# Altium schematic sheet Interface.SchDoc
size A
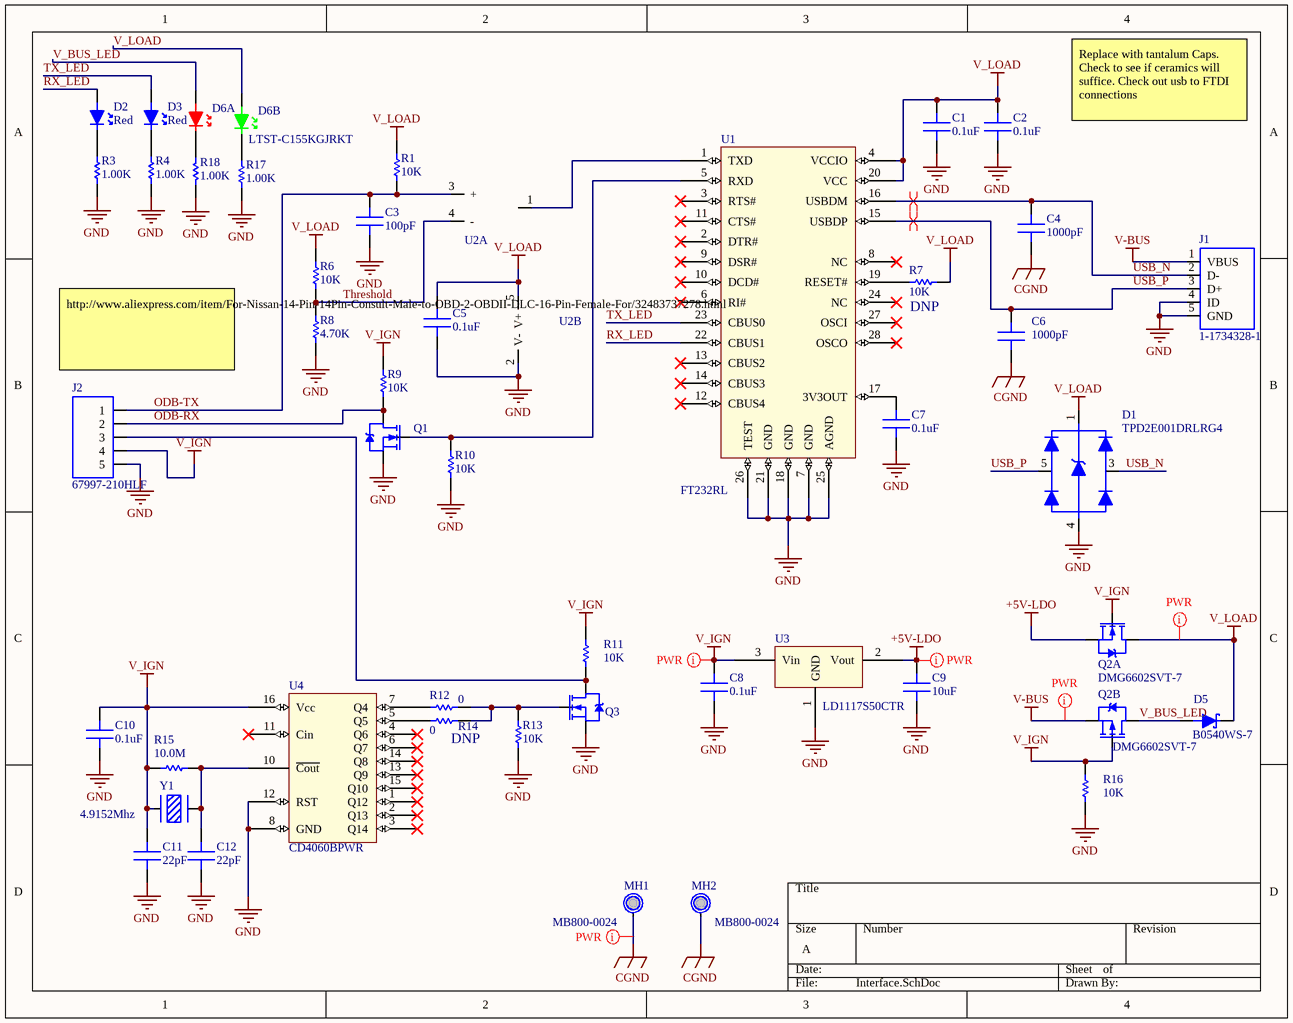
[diagram p0: Interface.SchDoc]

## Parts
C1  0.1uF  [0603]
C2  0.1uF  [0603]
C3  100pF  [0603]
C4  1000pF  [0603]
C5  0.1uF  [0603]
C6  1000pF  [0603]
C7  0.1uF  [0603]
C8  0.1uF  [0603]
C9  10uF  [0603]
C10  0.1uF  [0603]
C11  22pF  [0603]
C12  22pF  [0603]
D1  TPD2E001DRLRG4  [SOT-533]
D2  Red  [LED 0805]
D3  Red  [LED 0805]
D5  B0540WS-7  [SOD-323]
D6  LTST-C155KGJRKT  [LED DUAL 1210]  (value not drawn)  (parts A,B of 2)
J1  1-1734328-1  [USB_MINI_AB_SMT_POSTS]
J2  67997-210HLF  [HDR5X1PTH2.54MM]
MH1  MB800-0024  [Mount Hole M2.5]  (no BOM)
MH2  MB800-0024  [Mount Hole M2.5]  (no BOM)
Q1  FDV301N  [SOT-23-3]  (value not drawn)
Q2  DMG6602SVT-7  [SOT-23-6L]  (parts A,B of 2)
Q3  FDV301N  [SOT-23-3]  (value not drawn)
R1  10K  [0603]
R3  1.00K  [0603]
R4  1.00K  [0603]
R6  10K  [0603]
R7  10K  [0603]
R8  4.70K  [0603]
R9  10K  [0603]
R10  10K  [0603]
R11  10K  [0603]
R12  0  [0603]
R13  10K  [0603]
R14  0  [0603]
R15  10.0M  [0603]
R16  10K  [0603]
R17  1.00K  [0603]
R18  1.00K  [0603]
U1  FT232RL  [SSOP-28]
U2  MCP6L01T-E/OT  [SOT-23-5]  (value not drawn)  (parts A,B of 2)
U3  LD1117S50CTR  [SOT-223-3]
U4  CD4060BPWR  [TSSOP16]
Y1  4.9152Mhz  [HC49/US]

## Nets
+5V-LDO: C9.2 Q2.5(S1) U3.2(Vout)
CGND: C4.2 C6.1 J1.M1 J1.M2 J1.M3 J1.M4 MH1.0 MH2.0
GND: C1.1 C2.1 C3.1 C5.1 C7.1 C8.1 C9.1 C10.1 C11.1 C12.1 D1.4(GND) J1.4(ID) J1.5(GND) J2.5 Q1.2(S) Q3.2(S) R3.2 R4.2 R8.2 R10.2 R13.2 R16.2 R17.2 R18.2 U1.7(GND) U1.18(GND) U1.21(GND) U1.25(AGND) U1.26(TEST) U2.2(V-) U3.1(GND) U4.8(GND) U4.12(RST)
V-BUS: J1.1(VBUS) Q2.2(S2)
V_IGN: C8.2 C10.2 C11.2 J2.4 Q2.1(G1) Q2.3(G2) R9.1 R11.1 R15.1 R16.1 U3.3(Vin) U4.16(Vcc) Y1.1
V_LOAD: C1.2 C2.2 C5.2 D1.1(Vcc) D5.2(CATHODE) D6.3(A) Q2.6(D1) R1.1 R6.1 R7.2 U1.4(VCCIO) U1.20(VCC) U2.5(V+)
ODB-RX: J2.2 Q1.3(D) R9.2
ODB-TX: C3.2 J2.1 R1.2 U2.3(+)
RX_LED: D2.1(A) U1.22(CBUS1)
Threshold: R6.2 R8.1 U2.4(-)
TX_LED: D3.1(A) U1.23(CBUS0)
USB_N: C4.1 D1.3(IO1) J1.2(D-) U1.16(USBDM)
USB_P: C6.2 D1.5(IO2) J1.3(D+) U1.15(USBDP)
V_BUS_LED: D5.1(ANODE) D6.1(A) Q2.4(D2)
NetC7_2: C7.2 U1.17(3V3OUT)
NetC12_2: C12.2 R15.2 U4.10(~{Cout}) Y1.2
NetD2_2: D2.2(K) R3.1
NetD3_2: D3.2(K) R4.1
NetD6_2: D6.2(K) R18.1
NetD6_4: D6.4(K) R17.1
NetJ2_3: J2.3 Q3.3(D) R11.2
NetQ1_1: Q1.1(G) R10.1 U1.5(RXD)
NetQ3_1: Q3.1(G) R12.2 R13.1 R14.2
NetR7_1: R7.1 U1.19(RESET#)
NetR12_1: R12.1 U4.7(Q4)
NetR14_1: R14.1 U4.5(Q5)
NetU1_1: U1.1(TXD) U2.1(O)

Not connected (* = marked no-connect by the designer): D1 2(NC); U1 2(DTR#)* 3(RTS#)* 6(RI#)* 8(NC)* 9(DSR#)* 10(DCD#)* 11(CTS#)* 12(CBUS4)* 13(CBUS2)* 14(CBUS3)* 24(NC)* 27(OSCI)* 28(OSCO)*; U4 1(Q12)* 2(Q13)* 3(Q14)* 4(Q6)* 6(Q7)* 11(Cin)* 13(Q9)* 14(Q8)* 15(Q10)*

## Layout directives
differential pair: USB_N, USB_P
net class PWR: +5V-LDO, CGND, V-BUS, V_IGN, V_LOAD

## Notes on the sheet
- Replace with tantalum Caps. Check to see if ceramics will suffice. Check out usb to FTDI connections
- (near J2) http://www.aliexpress.com/item/For-Nissan-14-Pin-14Pin-Consult-Male-to-OBD-2-OBDII-DLC-16-Pin-Female-For/32483737278.html
- (near R7) DNP
- (near R14) DNP

## Library data of the parts
C1 C2 C5 C7 C8 C10 = MB200-0058: Ceramic Capacitor 0.1uF 50V +/-10% X7R SMT-0603; Manufacturer 1: Samsung; Manufacturer Part Number 1: CL10B104KB8NNNC; MakerBot Part Number: MB200-0058; Component Type: Capacitor; Component Subtype: Ceramic; RoHS Compliant: YES; Package: SMT-0603; Value: 0.1uF; Rated Voltage: 50V; Tolerance: +/-10%; Composition: X7R; Supplier 1: Arrow; Supplier Part Number 1: CL10B104KB8NNNC; Alt Supplier 1: Digikey; Alt Supplier Part Number 1: 1276-1000-1-ND; Manufacturer 2: Murata; Manufacturer Part Number 2: GRM188R71H104KA93D; Supplier 2: Arrow; Supplier Part Number 2: GRM188R71H104KA93D; Alt Supplier 2: Digikey; Alt Supplier Part Number 2: 490-1519-1-ND; Manufacturer 3: Kemet; Manufacturer Part Number 3: C0603C104K5RACTU; Supplier 3: Arrow; Supplier Part Number 3: C0603C104K5RACTU; Alt Supplier 3: Digikey; Alt Supplier Part Number 3: 399-5089-1-ND
C3 = MB200-0022: Ceramic Capacitor 100pF 50V +/-5% C0G SMT-0603; Manufacturer 1: TDK; Manufacturer Part Number 1: C1608C0G1H101J080AA; MakerBot Part Number: MB200-0022; Component Type: Capacitor; Component Subtype: Ceramic; RoHS Compliant: YES; Package: SMT-0603; Value: 100pF; Rated Voltage: 50V; Tolerance: +/-5%; Composition: C0G; Supplier 1: Arrow; Supplier Part Number 1: C1608C0G1H101J080AA; Alt Supplier 1: Digikey; Alt Supplier Part Number 1: 445-1281-1-ND; Manufacturer 2: Samsung; Manufacturer Part Number 2: CL10C101JB8NNNC; Supplier 2: Arrow; Supplier Part Number 2: CL10C101JB8NNNC; Alt Supplier 2: Digikey; Alt Supplier Part Number 2: 1276-1008-1-ND; Manufacturer 3: Murata; Manufacturer Part Number 3: GRM1885C1H101JA01D; Supplier 3: Arrow; Supplier Part Number 3: GRM1885C1H101JA01D; Alt Supplier 3: Digikey; Alt Supplier Part Number 3: 490-1427-1-ND
C4 C6 = C0603C102J5RACTU: Ceramic Capacitor 1000pF 50V +/-5% X7R SMT-0603; MakerBot Part Number: MB200-0223; Creation Part Number: MAK110-0001; Manufacturer 1: KEMET; Manufacturer Part Number 1: C0603C102J5RACTU; Component Type: Capacitor; Component Subtype: Ceramic; RoHS Compliant: YES; Package: SMT-0603; Value: 1000pF; Rated Voltage: 50V; Tolerance: +/-5%; Composition: X7R; Supplier 1: Digi-Key; Supplier Part Number 1: 399-1083-6-ND; Alt Supplier 1: Mouser; Alt Supplier Part Number 1: 80-C0603C102J5R
C9 = GRM188R60J106ME47J: Ceramic Capacitor 10uF 6.3V +/-20% X5R SMT-0603; MakerBot Part Number: MB200-0341; Manufacturer 1: MURATA ELECTRONICS; Manufacturer Part Number 1: GRM188R60J106ME47J; Component Type: Capacitor; Component Subtype: Ceramic; RoHS Compliant: YES; Manufacturer 2: SAMSUNG; Manufacturer Part Number 2: CL10A106MQ8NNNC; Package: SMT-0603; Value: 10uF; Rated Voltage: 6.3V; Tolerance: +/-20%; Composition: X5R; Supplier 1: Arrow; Supplier Part Number 1: GRM188R60J106ME47J; Alt Supplier 1: Digikey; Alt Supplier Part Number 1: 490-6405-1-ND; Supplier 2: Arrow; Supplier Part Number 2: CL10A106MQ8NNNC; Alt Supplier 2: Digikey; Alt Supplier Part Number 2: 1276-1119-1-ND
C11 C12 = MB200-0014: Ceramic Capacitor 22pF 50V +/-5% C0G SMT-0603; Manufacturer 1: TDK; Manufacturer Part Number 1: C1608C0G1H220J080AA; MakerBot Part Number: MB200-0014; Component Type: Capacitor; Component Subtype: Ceramic; RoHS Compliant: YES; Package: SMT-0603; Value: 22pF; Rated Voltage: 50V; Tolerance: +/-5%; Composition: C0G; Supplier 1: Arrow; Supplier Part Number 1: C1608C0G1H220J080AA; Alt Supplier 1: Digikey; Alt Supplier Part Number 1: 445-1273-1-ND; Manufacturer 2: Samsung; Manufacturer Part Number 2: CL10C220JB8NNNC; Supplier 2: Arrow; Supplier Part Number 2: CL10C220JB8NNNC; Alt Supplier 2: Digikey; Alt Supplier Part Number 2: 1276-1023-1-ND; Manufacturer 3: Murata; Manufacturer Part Number 3: GQM1885C1H220JB01D; Supplier 3: Arrow; Supplier Part Number 3: GQM1885C1H220JB01D; Alt Supplier 3: Digikey; Alt Supplier Part Number 3: 490-3575-1-ND
D1 = TPD2E001DRLRG4: Array Diode Vclamp = VCC+25V @ 10A SOT-5; MakerBot Part Number: MB500-0008; Creation Part Number: MAK120-0033; Manufacturer 1: TEXAS INSTRUMENTS; Forward Voltage: 0.65V @10mA; Reverse Current Rating: 10mA; Reverse or Zener Voltage: 11V @ 10mA; Capacitance: 1.5pF; Manufacturer Part Number 1: TPD2E001DRLRG4; Component Type: Diode; Component Subtype: Array; RoHS Compliant: YES; Package: SOT-533; Features: Vclamp = VCC+25V @ 10A; Supplier 1: Digi-Key; Supplier Part Number 1: 296-35960-2-ND; Alt Supplier 1: Mouser; Alt Supplier Part Number 1: 595-TPD2E001DRLRG4
D2 D3 = 598-8110-107F: Red LED, 2.2V @ 20mA, 40mcd, 0805; MakerBot Part Number: MB900-0003; Creation Part Number: MAK140-0004; Manufacturer 1: DIALIGHT; Wavelength: 635nm; Manufacturer Part Number 1: 598-8110-107F; Component Type: LED; RoHS Compliant: YES; Package: SMT-0805; Forward Voltage: 2.2V @ 20mA; Color: Red; Brightness: 40mcd; Supplier 1: Digikey; Supplier Part Number 1: 350-2038-1-ND; Alt Supplier 1: Mouser; Alt Supplier Part Number 1: 645-598-8110-107F
D5 = B0540WS-7: Schottky Diode 0.285 @ 10mA SOD-323; MakerBot Part Number: MB500-0007; Creation Part Number: MAK120-0015; Manufacturer 1: DIODES INC; Forward Current Rating: 0.5A; Reverse Current Rating: 2 uA; Reverse or Zener Voltage: 40V @ 1mA; Capacitance: 125 pF; Manufacturer Part Number 1: B0540WS-7; Component Type: Diode; Component Subtype: Schottky; RoHS Compliant: YES; Package: SOD-323; Forward Voltage: 0.285 @ 10mA; Supplier 1: Digi-Key; Supplier Part Number 1: B0540WSDIDKR-ND; Alt Supplier 1: Mouser; Alt Supplier Part Number 1: 621-B0540WS-7
D6 = LTST-C155KGJRKT: Bicolor LED, Red/Green, 2V @20mA, 35/45mcd, 1210; MakerBot Part Number: MB900-0011; Manufacturer 1: LITE-ON; Forward Voltage: 2V Red. 2V Green; Wavelength: 631nm, 571nm; Brightness: 45mcd Red, 35mcd Green; Manufacturer Part Number 1: LTST-C155KGJRKT; Component Type: LED; Component Subtype: Red/Green; RoHS Compliant: YES; Package: SMT-1210; Color: Red/Green; Supplier 1: Digi-Key; Supplier Part Number 1: 160-1409-1-ND; Alt Supplier 1: Mouser; Alt Supplier Part Number 1: 859-LTST-C155KGJRKT
J1 = 1-1734328-1: USB 2.0 Mini-AB Connector w/PTH Alignment Posts; MakerBot Part Number: MB700-0092; Manufacturer 1: TE Connectivity; Component Subtype: USB-MiniAB; Manufacturer Part Number 1: 1-1734328-1; Component Type: Connector; RoHS Compliant: Yes; Package: SMT-USB-miniAB; Features: USB 2.0 SMT signal pads with PTH Alignment posts; Supplier 1: Digikey; Supplier Part Number 1: A114944-ND; Alt Supplier 1: Mouser; Alt Supplier Part Number 1: 571-1-1734328-1
J2 = 67997-210HLF: header male 5x1 vertical 2.54MM; MakerBot Part Number: MB700-0188; Manufacturer 1: FCI; Component Subtype: 5 Pos; Component Type: Connector; RoHS Compliant: YES; Manufacturer Part Number 1: 67997-210HLF; Package: PTH-5pos_2.54mm_5x1; Features: Male, through hole, 5x1, 0.1"pitch; Supplier 1: Digi-Key; Supplier Part Number 1: 609-3236-ND
MH1 MH2 = MB800-0024: Mounting Hole for M2.5 Screw; Manufacturer 1: MAKERBOT; Manufacturer Part Number 1: MB800-0024; MakerBot Part Number: MB800-0024; Component Type: Mount Hole; Component Subtype: M2.5; RoHS Compliant: YES; Package: PTH-M2.5
Q1 Q3 = FDV301N: MOSFET, N-CH, 25Vds, 0.22A Id, 0.35W, SOT-23-3; MakerBot Part Number: MB600-0011; Creation Part Number: MAK120-0057; Manufacturer 1: FAIRCHILD SEMI; Component Subtype: N-Channel; Qg: 0.7nC; Vds(max): 25V; Vgs(th): 0.7V to 1.06V; Vgs(max): 8V; Rds On: 5 Ohms; Manufacturer Part Number 1: FDV301N; Component Type: MOSFET; RoHS Compliant: YES; Package: SOT-23-3; Id: 0.22A; Ptot: 0.35W; Supplier 1: Digikey; Supplier Part Number 1: FDV301NTR-ND; Alt Supplier 1: Mouser; Alt Supplier Part Number 1: 512-FDV301N
Q2 = DMG6602SVT-7: MOSFET, Dual N /P Channel, +/-30Vds, 3.4A/-2.7A Id, 0.84W, SOT-23-6L; MakerBot Part Number: MB600-0014; Creation Part Number: MAK120-0076; Manufacturer 1: DIODES INC; Component Subtype: Dual N/P-Channel; Id: 3.4A / -2.8A; Qg: 13nC / 9 nC; Vds(max): +/- 30 V; Vgs(th): 1.0V to 2.3V / -1.0V to -2.3V; Vgs(max): +/- 20 V; Rds On: 0.1 Ohms / 0.14 Ohms; Manufacturer Part Number 1: DMG6602SVT-7; Component Type: MOSFET; RoHS Compliant: YES; Package: SOT-23-6L; Ptot: 0.84 W; Supplier 1: Digi-Key; Supplier Part Number 1: DMG6602SVT-7DITR-ND; Alt Supplier 1: Mouser; Alt Supplier Part Number 1: 621-DMG6602SVT-7
R1 R6 R7 R9-R11 R13 R16 = MB100-0457: Resistor 10K 1% 1/10W SMT-0603; Manufacturer 1: Vishay Dale; Manufacturer Part Number 1: CRCW060310K0FKEA; MakerBot Part Number: MB100-0457; Component Type: Resistor; RoHS Compliant: YES; Package: SMT-0603; Value: 10K; Tolerance: 1%; Power: 1/10W; Composition: Thick Film; Supplier 1: Arrow; Supplier Part Number 1: CRCW060310K0FKEA; Alt Supplier 1: Digikey; Alt Supplier Part Number 1: 541-10.0KHCT-ND; Manufacturer 2: Panasonic; Manufacturer Part Number 2: ERJ-3EKF1002V; Supplier 2: Arrow; Supplier Part Number 2: ERJ-3EKF1002V; Alt Supplier 2: Digikey; Alt Supplier Part Number 2: P10.0KHTR-ND; Manufacturer 3: Stackpole Electronics; Manufacturer Part Number 3: RMCF0603FT10K0; Supplier 3: Arrow; Supplier Part Number 3: RMCF0603FT10K0; Alt Supplier 3: Digikey; Alt Supplier Part Number 3: RMCF0603FT10K0TR-ND
R3 R4 R17 R18 = MB100-0343: Resistor 1.00K 1% 1/10W SMT-0603; Manufacturer 1: Vishay Dale; Manufacturer Part Number 1: CRCW06031K00FKEA; MakerBot Part Number: MB100-0343; Component Type: Resistor; RoHS Compliant: YES; Package: SMT-0603; Value: 1.00K; Tolerance: 1%; Power: 1/10W; Composition: Thick Film; Supplier 1: Arrow; Supplier Part Number 1: CRCW06031K00FKEA; Alt Supplier 1: Digikey; Alt Supplier Part Number 1: 541-1.00KHCT-ND; Manufacturer 2: Panasonic; Manufacturer Part Number 2: ERJ-3EKF1001V; Supplier 2: Arrow; Supplier Part Number 2: ERJ-3EKF1001V; Alt Supplier 2: Digikey; Alt Supplier Part Number 2: P1.00KHTR-ND; Manufacturer 3: Stackpole Electronics; Manufacturer Part Number 3: RMCF0603FT1K00; Supplier 3: Arrow; Supplier Part Number 3: RMCF0603FT1K00; Alt Supplier 3: Digikey; Alt Supplier Part Number 3: RMCF0603FT1K00TR-ND
R8 = MB100-0419: Resistor 4.70K 1% 1/10W SMT-0603; Manufacturer 1: Vishay Dale; Manufacturer Part Number 1: CRCW06034K70FKEA; MakerBot Part Number: MB100-0419; Component Type: Resistor; RoHS Compliant: YES; Package: SMT-0603; Value: 4.70K; Tolerance: 1%; Power: 1/10W; Composition: Thick Film; Supplier 1: Arrow; Supplier Part Number 1: CRCW06034K70FKEA; Alt Supplier 1: Digikey; Alt Supplier Part Number 1: 541-4.70KHCT-ND; Manufacturer 2: Panasonic; Manufacturer Part Number 2: ERJ-3EKF4701V; Supplier 2: Arrow; Supplier Part Number 2: ERJ-3EKF4701V; Alt Supplier 2: Digikey; Alt Supplier Part Number 2: P4.70KHTR-ND; Manufacturer 3: Stackpole Electronics; Manufacturer Part Number 3: RMCF0603FT4K70; Supplier 3: Arrow; Supplier Part Number 3: RMCF0603FT4K70; Alt Supplier 3: Digikey; Alt Supplier Part Number 3: RMCF0603FT4K70TR-ND
R12 R14 = CRCW06030000Z0EA: Resistor 0 1% 1/10W SMT-0603; MakerBot Part Number: MB100-0801; Creation Part Number: MAK100-0002; Manufacturer 1: VISHAY DALE; Manufacturer Part Number 1: CRCW06030000Z0EA; Component Type: Resistor; RoHS Compliant: YES; Package: SMT-0603; Value: 0; Tolerance: 1%; Power: 1/10W; Composition: Thick Film; Supplier 1: Digikey; Supplier Part Number 1: 541-0.0GTR-ND; Alt Supplier 1: Mouser; Alt Supplier Part Number 1: 71-CRCW0603-0-E3
R15 = MB100-0799: Resistor 10.0M 1% 1/10W SMT-0603; Manufacturer 1: Vishay Dale; Manufacturer Part Number 1: CRCW060310M0FKEA; MakerBot Part Number: MB100-0799; Component Type: Resistor; RoHS Compliant: YES; Package: SMT-0603; Value: 10.0M; Tolerance: 1%; Power: 1/10W; Composition: Thick Film; Supplier 1: Arrow; Supplier Part Number 1: CRCW060310M0FKEA; Alt Supplier 1: Digikey; Alt Supplier Part Number 1: 541-10.0MHCT-ND; Manufacturer 3: Stackpole Electronics; Manufacturer Part Number 3: RMCF0603FT10M0; Supplier 3: Arrow; Supplier Part Number 3: RMCF0603FT10M0; Alt Supplier 3: Digikey; Alt Supplier Part Number 3: RMCF0603FT10M0TR-ND
U1 = FT232RL: Bridge, USB to UART; MakerBot Part Number: MB400-0169; Manufacturer 1: FTDI; Operating Voltage: 3.3V to 5.25V; Manufacturer Part Number 1: FT232RL; Component Type: Interface; Component Subtype: USB to UART; RoHS Compliant: YES; Package: SSOP-28; Features: Bridge, USB to UART; Supplier 1: Digikey; Supplier Part Number 1: 768-1007-1-ND
U2 = MCP6L01T-E/OT: Single General Purpose Rail-to-rail Opamp, 1MHz GBP, 0.6V/uS; MakerBot Part Number: MB400-0070; Manufacturer 1: MICROCHIP TECHNOLOGY; Operating Voltage: 1.8V to 6V; Manufacturer Part Number 1: MCP6L01T-E/OT; Component Type: Opamp; Component Subtype: Single; RoHS Compliant: YES; Package: SOT-23-5; Features: 2pA bias, 1mV input offset, 20mA output, Rail-to-Rail; Supplier 1: Digikey; Supplier Part Number 1: MCP6L01T-E/OTCT-ND; Alt Supplier 1: Mouser; Alt Supplier Part Number 1: 579-MCP6L01T-E/OT
U3 = LD1117S50CTR: IC REG LDO 5V 0.8A SOT223; MakerBot Part Number: MB400-0151; Manufacturer 1: ST MICROELECTRONICS; Component Subtype: Step-down; Operating Voltage: 15V Max; Manufacturer Part Number 1: LD1117S50CTR; Component Type: Regulator; RoHS Compliant: YES; Package: SOT-22-3; Features: IC REG LDO 5V 0.8A SOT223; Supplier 1: Digikey; Supplier Part Number 1: 497-1243-1-ND
U4 = CD4060BPWR: IC BNRY COUNTR/DIV 14STG 16TSSOP; MakerBot Part Number: MB400-0150; Manufacturer 1: TEXAS INSTRUMENTS; Component Subtype: Counter / Divider; Operating Voltage: 3V to 18V; Manufacturer Part Number 1: CD4060BPWR; Component Type: Logic; RoHS Compliant: YES; Package: 16-TSSOP; Features: IC BNRY COUNTR/DIV 14STG 16TSSOP; Supplier 1: Digikey; Supplier Part Number 1: 296-14119-1-ND
Y1 = ATS042SM-1: Crystal 8MHz HC49/US 11.4mmx4.7 mm 30ppm; MakerBot Part Number: MB1001-0014; Manufacturer 1: CTS CORPORATION; Stability: 51 PPM; Tolerance: 31 PPM; Load Capacitance: 20pF; Manufacturer Part Number 1: ATS042SM-1; Component Type: Crystal; RoHS Compliant: YES; Package: SMT- 11.4mm x 4.7mm; Frequency: 4.9152Mhz; Supplier 1: Digikey; Supplier Part Number 1: CTX503CT-ND